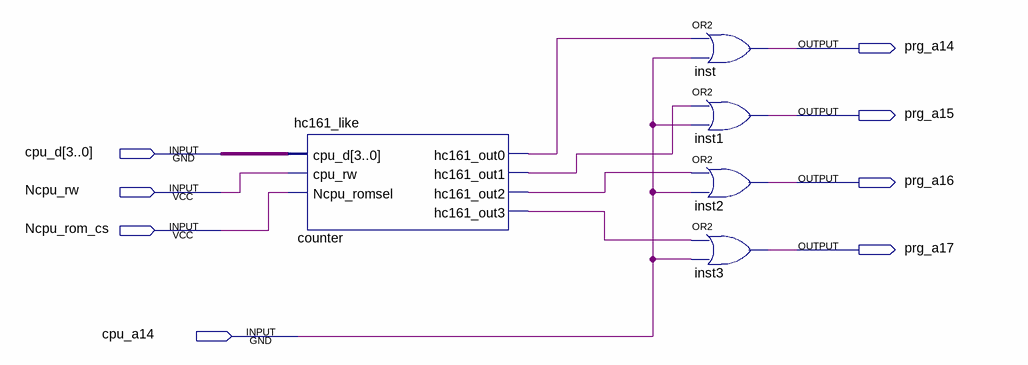
[diagram p0: schematic sheet]
// Quartus schematic UNROM_mst.bdf as structural Verilog: 5 symbols, 8 pins
module UNROM_mst (
  input  [3:0] cpu_d,
  input  Ncpu_rw,
  input  Ncpu_rom_cs,
  input  cpu_a14,
  output prg_a14,
  output prg_a15,
  output prg_a16,
  output prg_a17
);

  wire counter_hc161_out0, counter_hc161_out1, counter_hc161_out2, counter_hc161_out3;

  hc161_like counter (
    .cpu_d(cpu_d), .cpu_rw(Ncpu_rw), .Ncpu_romsel(Ncpu_rom_cs), .hc161_out0(counter_hc161_out0),
    .hc161_out1(counter_hc161_out1), .hc161_out2(counter_hc161_out2), .hc161_out3(counter_hc161_out3));
  or inst (prg_a14, counter_hc161_out0, cpu_a14);
  or inst1 (prg_a15, counter_hc161_out1, cpu_a14);
  or inst2 (prg_a16, counter_hc161_out2, cpu_a14);
  or inst3 (prg_a17, counter_hc161_out3, cpu_a14);
endmodule
